# Altium project CTR-Dome-Rev-B.PrjPcb
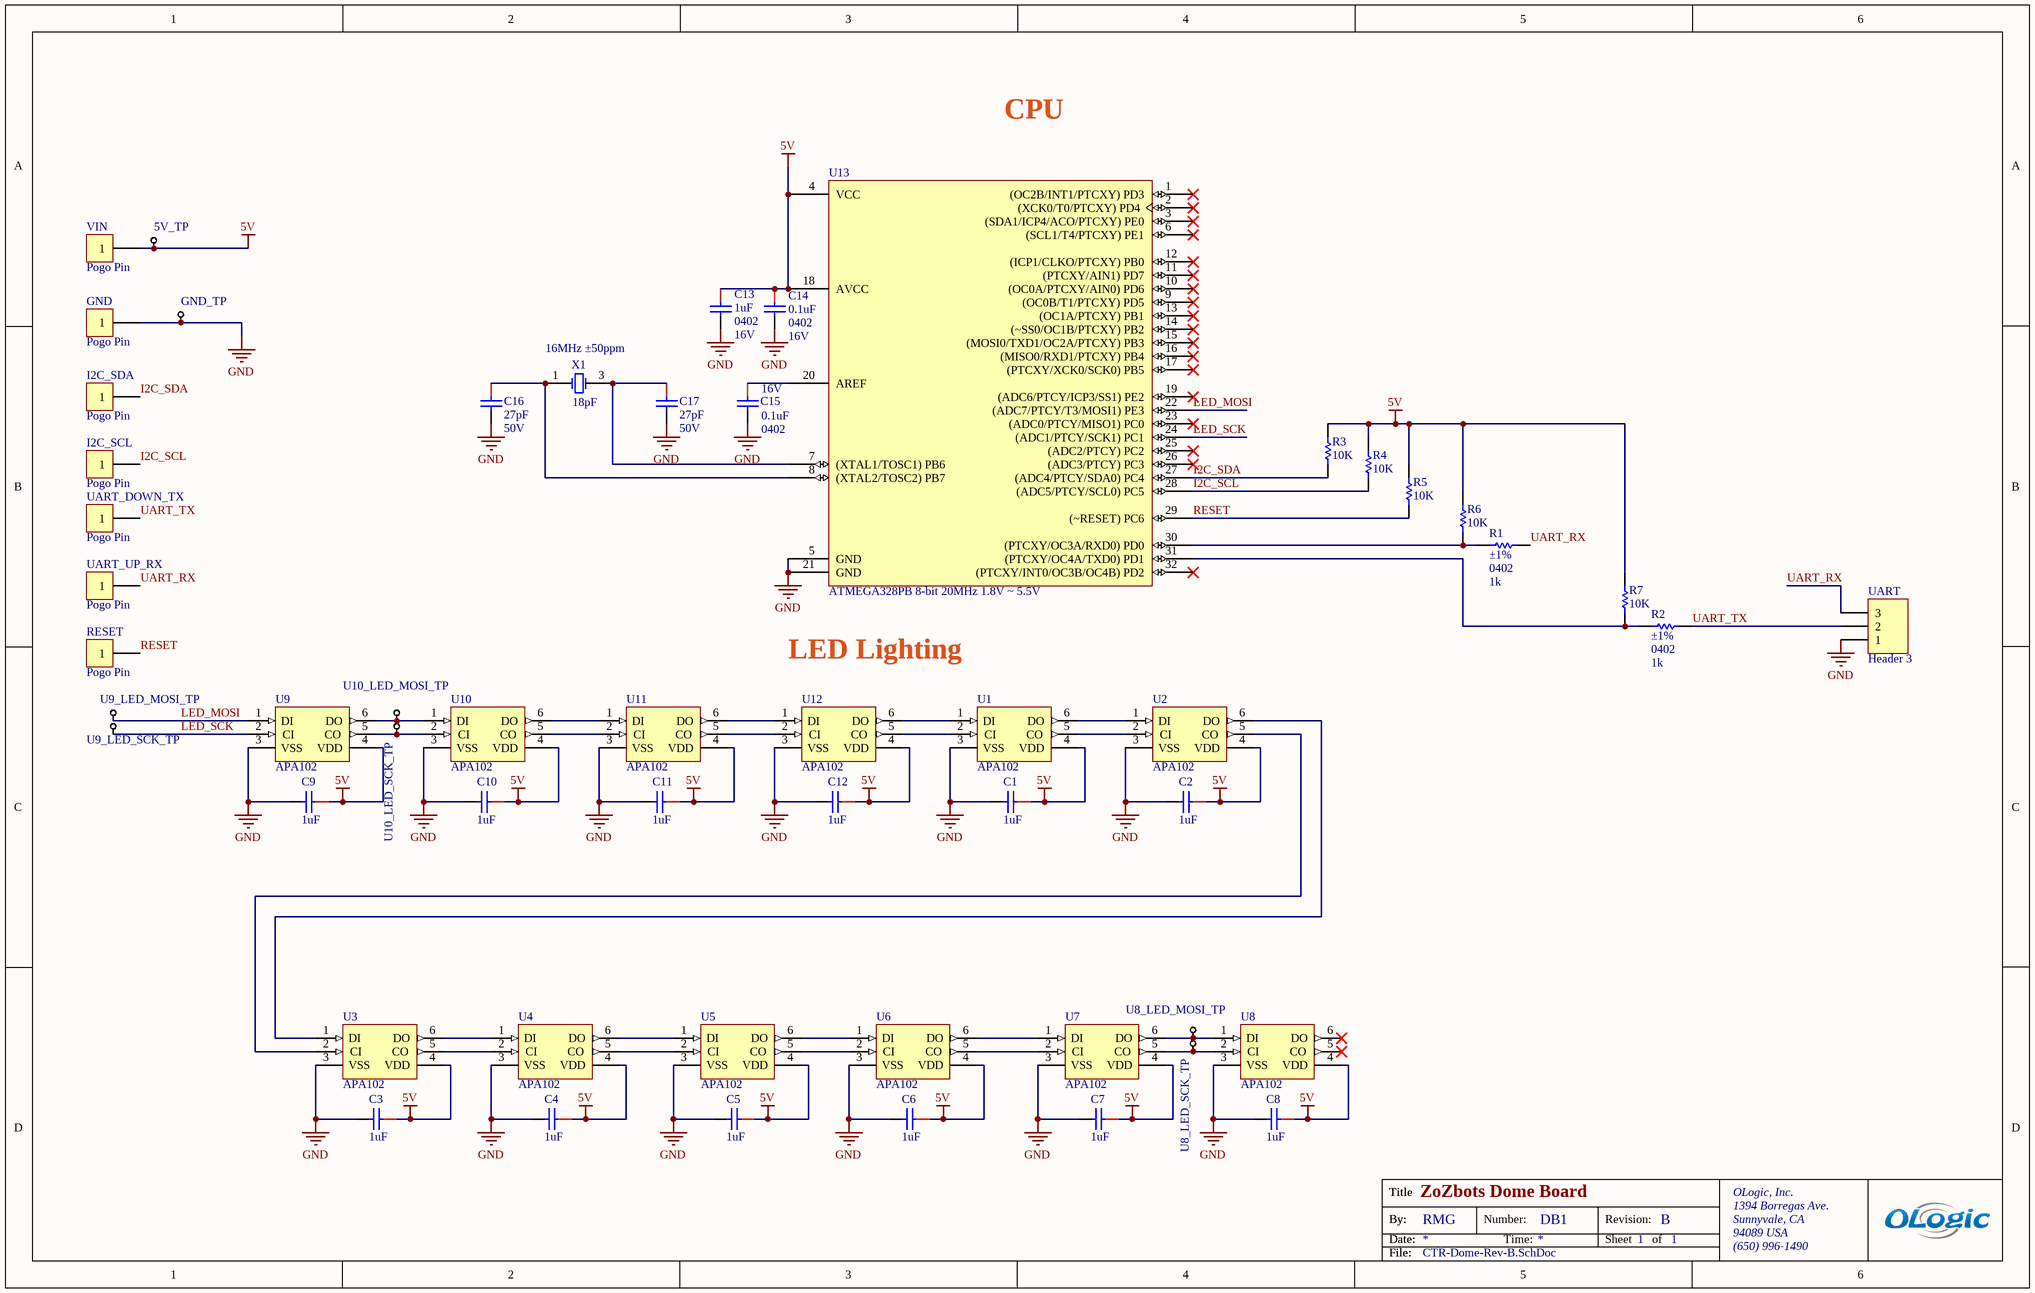
[diagram p0: CTR-Dome-Rev-B.SchDoc]
1 sheet, 54 parts. Net scope: hierarchical (ports join the sheet entries above them; power ports are global).
Board file: CTR-Dome-Rev-B.PcbDoc

## Sheet CTR-Dome-Rev-B.SchDoc: ZoZbots Dome Board
size B; Author: RMG; Organization: OLogic, Inc.; DocumentNumber: DB1; Revision: B; SheetNumber: 1; SheetTotal: 1; PageSetup: Record=PageOptions|CenterHorizontal=True|CenterVertical=True|PrintScale=0.70|XCorrection=1.00|YCorrection=1.00|PrintKind=0|BorderSize=5000000|LeftOffset=0|BottomOffset=0|Orientation=2|PaperLength=1000|PaperWidth=1000|Scale=100|PaperSource=15|PrintQuality=600|MediaType=1|DitherType=10|PrintScaleMode=1|PaperKind=Letter|PaperIndex=1

### Parts
5V_TP  Test Point  [TestPoint-TH 42 mil]  (value not drawn)  (no BOM)
C1  1uF  [CAPC0402(1005)_N]
C2  1uF  [CAPC0402(1005)_N]
C3  1uF  [CAPC0402(1005)_N]
C4  1uF  [CAPC0402(1005)_N]
C5  1uF  [CAPC0402(1005)_N]
C6  1uF  [CAPC0402(1005)_N]
C7  1uF  [CAPC0402(1005)_N]
C8  1uF  [CAPC0402(1005)_N]
C9  1uF  [CAPC0402(1005)_N]
C10  1uF  [CAPC0402(1005)_N]
C11  1uF  [CAPC0402(1005)_N]
C12  1uF  [CAPC0402(1005)_N]
C13  1uF  Voltage - Rated: 16V  Package / Case: 0402  [CAPC0402(1005)_N]
C14  0.1uF  Package / Case: 0402  Voltage - Rated: 16V  [CAPC0402(1005)_N]
C15  0.1uF  Package / Case: 0402  Voltage - Rated: 16V  [CAPC0402(1005)_N]
C16  27pF  Voltage - Rated: 50V  [CAPC0402(1005)_N]
C17  27pF  Voltage - Rated: 50V  [CAPC0402(1005)_N]
GND  Pogo Pin  [POGO_PIN]
GND_TP  Test Point  [TestPoint-TH 42 mil]  (value not drawn)  (no BOM)
I2C_SCL  Pogo Pin  [POGO_PIN]
I2C_SDA  Pogo Pin  [POGO_PIN]
R1  Tolerance: ±1%  Supplier Device Package: 0402  [RESC0402(1005)_N]  (hidden comment: 1K)
R2  Tolerance: ±1%  Supplier Device Package: 0402  [RESC0402(1005)_N]  (hidden comment: 1K)
R3  10K  [RESC0603(1608)_N]
R4  10K  [RESC0603(1608)_N]
R5  10K  [RESC0603(1608)_N]
R6  10K  [RESC0603(1608)_N]
R7  10K  [RESC0603(1608)_N]
RESET  Pogo Pin  [POGO_PIN]
U1  APA102  [APA102C]
U2  APA102  [APA102C]
U3  APA102  [APA102C]
U4  APA102  [APA102C]
U5  APA102  [APA102C]
U6  APA102  [APA102C]
U7  APA102  [APA102C]
U8  APA102  [APA102C]
U8_LED_MOSI_TP  Test Point  [TestPoint-TH 42 mil]  (value not drawn)  (no BOM)
U8_LED_SCK_TP  Test Point  [TestPoint-TH 42 mil]  (value not drawn)  (no BOM)
U9  APA102  [APA102C]
U9_LED_MOSI_TP  Test Point  [TestPoint-TH 42 mil]  (value not drawn)  (no BOM)
U9_LED_SCK_TP  Test Point  [TestPoint-TH 42 mil]  (value not drawn)  (no BOM)
U10  APA102  [APA102C]
U10_LED_MOSI_TP  Test Point  [TestPoint-TH 42 mil]  (value not drawn)  (no BOM)
U10_LED_SCK_TP  Test Point  [TestPoint-TH 42 mil]  (value not drawn)  (no BOM)
U11  APA102  [APA102C]
U12  APA102  [APA102C]
U13  ATMEGA328PB 8-bit 20MHz 1.8V ~ 5.5V  [QFN 32 (VFQFN ATMEL ATMEGA)]
UART  Header 3  [HDR1X3]  (no BOM)
UART_DOWN_TX  Pogo Pin  [POGO_PIN]
UART_UP_RX  Pogo Pin  [POGO_PIN]
VIN  Pogo Pin  [POGO_PIN]
X1  16MHz ±50ppm  Load Capacitance: 18pF  [SMXOSC/3.2X2.5]

### Nets
5V: 5V_TP.1 C1.1 C2.1 C3.1 C4.1 C5.1 C6.1 C7.1 C8.1 C9.1 C10.1 C11.1 C12.1 C13.1 C14.1 R3.2 R4.2 R5.2 R6.2 R7.2 U1.4(VDD) U2.4(VDD) U3.4(VDD) U4.4(VDD) U5.4(VDD) U6.4(VDD) U7.4(VDD) U8.4(VDD) U9.4(VDD) U10.4(VDD) U11.4(VDD) U12.4(VDD) U13.4(VCC) U13.18(AVCC) VIN.1
GND: C1.2 C2.2 C3.2 C4.2 C5.2 C6.2 C7.2 C8.2 C9.2 C10.2 C11.2 C12.2 C13.2 C14.2 C15.2 C16.2 C17.2 GND.1 GND_TP.1 U1.3(VSS) U2.3(VSS) U3.3(VSS) U4.3(VSS) U5.3(VSS) U6.3(VSS) U7.3(VSS) U8.3(VSS) U9.3(VSS) U10.3(VSS) U11.3(VSS) U12.3(VSS) U13.5(GND) U13.21(GND) U13.33 UART.1
I2C_SCL: I2C_SCL.1 R4.1 U13.28((ADC5/PTCY/SCL0)_PC5)
I2C_SDA: I2C_SDA.1 R3.1 U13.27((ADC4/PTCY/SDA0)_PC4)
LED_MOSI: U9.1(DI) U9_LED_MOSI_TP.1 U13.22((ADC7/PTCY/T3/MOSI1)_PE3)
LED_SCK: U9.2(CI) U9_LED_SCK_TP.1 U13.24((ADC1/PTCY/SCK1)_PC1)
RESET: R5.1 RESET.1 U13.29((~RESET)_PC6)
UART_RX: R1.2 UART.3 UART_UP_RX.1
UART_TX: R2.2 UART.2 UART_DOWN_TX.1
NetC15_1: C15.1 U13.20(AREF)
NetC16_1: C16.1 U13.8((XTAL2/TOSC2)_PB7) X1.1(OSC1)
NetC17_1: C17.1 U13.7((XTAL1/TOSC1)_PB6) X1.3(OSC2)
NetR1_1: R1.1 R6.1 U13.30((PTCXY/OC3A/RXD0)_PD0)
NetR2_1: R2.1 R7.1 U13.31((PTCXY/OC4A/TXD0)_PD1)
NetU1_1: U1.1(DI) U12.6(DO)
NetU1_2: U1.2(CI) U12.5(CO)
NetU1_5: U1.5(CO) U2.2(CI)
NetU1_6: U1.6(DO) U2.1(DI)
NetU2_5: U2.5(CO) U3.2(CI)
NetU2_6: U2.6(DO) U3.1(DI)
NetU3_5: U3.5(CO) U4.2(CI)
NetU3_6: U3.6(DO) U4.1(DI)
NetU4_5: U4.5(CO) U5.2(CI)
NetU4_6: U4.6(DO) U5.1(DI)
NetU5_5: U5.5(CO) U6.2(CI)
NetU5_6: U5.6(DO) U6.1(DI)
NetU6_5: U6.5(CO) U7.2(CI)
NetU6_6: U6.6(DO) U7.1(DI)
NetU7_5: U7.5(CO) U8.2(CI) U8_LED_SCK_TP.1
NetU7_6: U7.6(DO) U8.1(DI) U8_LED_MOSI_TP.1
NetU9_5: U9.5(CO) U10.2(CI) U10_LED_SCK_TP.1
NetU9_6: U9.6(DO) U10.1(DI) U10_LED_MOSI_TP.1
NetU10_5: U10.5(CO) U11.2(CI)
NetU10_6: U10.6(DO) U11.1(DI)
NetU11_5: U11.5(CO) U12.2(CI)
NetU11_6: U11.6(DO) U12.1(DI)

Not connected (* = marked no-connect by the designer): U8 5(CO)* 6(DO)*; U13 1((OC2B/INT1/PTCXY)_PD3)* 2((XCK0/T0/PTCXY)_PD4)* 3((SDA1/ICP4/ACO/PTCXY)_PE0)* 6((SCL1/T4/PTCXY)_PE1)* 9((OC0B/T1/PTCXY)_PD5)* 10((OC0A/PTCXY/AIN0)_PD6)* 11((PTCXY/AIN1)_PD7)* 12((ICP1/CLKO/PTCXY)_PB0)* 13((OC1A/PTCXY)_PB1)* 14((~SS0/OC1B/PTCXY)_PB2)* 15((MOSI0/TXD1/OC2A/PTCXY)_PB3)* 16((MISO0/RXD1/PTCXY)_PB4)* 17((PTCXY/XCK0/SCK0)_PB5)* 19((ADC6/PTCY/ICP3/SS1)_PE2)* 23((ADC0/PTCY/MISO1)_PC0)* 25((ADC2/PTCY)_PC2)* 26((ADC3/PTCY)_PC3)* 32((PTCXY/INT0/OC3B/OC4B)_PD2)*; X1 2(NC) 4(NC)

### Notes on the sheet
- CPU
- LED Lighting
- Title
- By:
- Date:
- Number:
- Time:
- Revision:
- Sheet
- of
- OLogic, Inc.
- 1394 Borregas Ave.
- Sunnyvale, CA
- 94089 USA
- File:
- (650) 996-1490

### Library data of the parts
5V_TP GND_TP U8_LED_MOSI_TP U8_LED_SCK_TP U9_LED_MOSI_TP U9_LED_SCK_TP U10_LED_MOSI_TP U10_LED_SCK_TP = TestPoint, small
C1-C12 = CAP CER 1UF 16V 10% X5R 0402: 1UF 0402; Manufacturer: TDK Corporation; Manufacturer Part Number: C1005X5R1C105K050BC; Capacitance: 1.0µF; Tolerance: ±10%; Voltage - Rated: 16V; Temperature Coefficient: X5R; ClassName: LED; Supplier 1: Digi-Key; RoHS: RoHS Compliant; Category: Capacitors; Stock 1: 490204; Pricing 1: 1=0.12, 10=0.08, 100=0.038, 250=0.032, 500=0.0268, 1000=0.022, 5000=0.0186 (USD); Packaging: Cut Tape (CT); Mounting Type: Surface Mount, MLCC; Operating Temperature: -55°C ~ 85°C; Applications: General Purpose; Ratings: -; Package / Case: 0402 (1005 Metric); Size / Dimension: 0.039" L x 0.020" W (1.00mm x 0.50mm); Height - Seated (Max): -; Thickness (Max): 0.022" (0.55mm); Lead Spacing: -; Features: -; Lead Style: -; ComponentLink1URL: http://product.tdk.com/en/catalog/datasheets/mlcc_commercial_general_en.pdf; ComponentLink1Description: http://product.tdk.com/en/catalog/datasheets/mlcc_commercial_general_en.pdf; Supplier Part Number 1: 445-4978-1-ND
C13 = CAP CER 1UF 16V 10% X5R 0402: 1UF 0402; Manufacturer: TDK Corporation; Manufacturer Part Number: C1005X5R1C105K050BC; Capacitance: 1.0µF; Tolerance: ±10%; Temperature Coefficient: X5R; ClassName: LED; Supplier 1: Digi-Key; RoHS: RoHS Compliant; Category: Capacitors; Stock 1: 490204; Pricing 1: 1=0.12, 10=0.08, 100=0.038, 250=0.032, 500=0.0268, 1000=0.022, 5000=0.0186 (USD); Packaging: Cut Tape (CT); Mounting Type: Surface Mount, MLCC; Operating Temperature: -55°C ~ 85°C; Applications: General Purpose; Ratings: -; Size / Dimension: 0.039" L x 0.020" W (1.00mm x 0.50mm); Height - Seated (Max): -; Thickness (Max): 0.022" (0.55mm); Lead Spacing: -; Features: -; Lead Style: -; ComponentLink1URL: http://product.tdk.com/en/catalog/datasheets/mlcc_commercial_general_en.pdf; ComponentLink1Description: http://product.tdk.com/en/catalog/datasheets/mlcc_commercial_general_en.pdf; Supplier Part Number 1: 445-4978-1-ND
C14 C15 = CAP CER 0.1UF 16V 10% X5R 0402: 0.1uF 0402 16V; Manufacturer: Taiyo Yuden; Manufacturer Part Number: EMK105BJ104KV-F; Capacitance: 0.1µF; Tolerance: ±10%; Temperature Coefficient: X5R; Supplier 1: Digi-Key; RoHS: RoHS Compliant; Category: Capacitors; Stock 1: 590000; Pricing 1: 10000=0.0042, 20000=0.004, 30000=0.0038, 50000=0.0034 (USD); Packaging: Tape & Reel (TR); Mounting Type: Surface Mount, MLCC; Operating Temperature: -55°C ~ 85°C; Applications: General Purpose; Ratings: -; Size / Dimension: 0.039" L x 0.020" W (1.00mm x 0.50mm); Height - Seated (Max): -; Thickness (Max): 0.022" (0.55mm); Lead Spacing: -; Features: -; Lead Style: -; ComponentLink1URL: http://www.yuden.co.jp/or/product/category/capacitor/EMK105BJ104KV-F.pdf; ComponentLink1Description: http://www.yuden.co.jp/or/product/category/capacitor/EMK105BJ104KV-F.pdf; Supplier Part Number 1: 587-1226-2-ND
C16 C17 = CAP CER 27PF 50V C0G/NP0 0402: 27PF ±5% 50V 0402; Manufacturer: Samsung Electro-Mechanics America, Inc.; Manufacturer Part Number: CL05C270JB5NNNC; Temperature Coefficient: C0G, NP0; Supplier 1: Digi-Key; RoHS: RoHS Compliant; Category: Capacitors; Stock 1: 380291; Pricing 1: 1=0.1, 10=0.012, 25=0.0088, 50=0.0066, 100=0.0055, 250=0.00456, 500=0.0039, 1000=0.00306, 5000=0.00256 (USD); Packaging: Cut Tape (CT); Part Status: Active; Capacitance: 27pF; Tolerance: ±5%; Operating Temperature: -55°C ~ 125°C; Features: -; Ratings: -; Applications: General Purpose; Mounting Type: Surface Mount, MLCC; Package / Case: 0402 (1005 Metric); Size / Dimension: 0.039" L x 0.020" W (1.00mm x 0.50mm); Height - Seated (Max): -; Thickness (Max): 0.022" (0.55mm); Lead Spacing: -; Lead Style: -; ComponentLink1URL: http://www.samsungsem.com/kr/support/product-search/mlcc/CL05C270JB5NNNC.jsp; ComponentLink1Description: http://www.samsungsem.com/kr/support/product-search/mlcc/CL05C270JB5NNNC.jsp; Supplier Part Number 1: 1276-1153-1-ND
GND I2C_SCL I2C_SDA RESET UART_DOWN_TX UART_UP_RX VIN = 0850-0-15-20-83-14-11-0: Manufacturer: Mill-Max Manufacturing Corp.; Plating: Gold; Plating - Thickness: 20µin (0.51µm); Supplier 1: Digi-Key; Manufacturer Part Number: 0850-0-15-20-83-14-11-0; RoHS: RoHS Compliant; Category: Connectors, Interconnects; Stock 1: 38651; Pricing 1: 1=1.89, 10=1.47, 25=1.3708, 50=1.246, 100=1.1214, 250=0.94696, 500=0.89712, 1000=0.79744, 2500=0.66287 (USD); Part Status: Active; Material: Copper Alloy; Mounting Type: Through Hole; ComponentLink1URL: http://www.mill-max.com/assets/pdfs/028.pdf; ComponentLink1Description: http://www.mill-max.com/assets/pdfs/028.pdf; Supplier Part Number 1: ED90436-ND
R1 R2 = RES 1K OHM 1% 1/10W 0402: 1K 0402; Manufacturer: Panasonic Electronic Components; Manufacturer Part Number: ERJ-2RKF1001X; Power (Watts): 0.1W, 1/10W; Temperature Coefficient: ±100ppm/°C; Supplier 1: Digi-Key; RoHS: RoHS Compliant; Category: Resistors; Stock 1: 3895934; Pricing 1: 1=0.1, 50=0.0196, 100=0.0149, 250=0.01104, 500=0.00816, 1000=0.00544, 5000=0.00383 (USD); Packaging: Cut Tape (CT); Composition: Thick Film; Features: Automotive AEC-Q200; Operating Temperature: -55°C ~ 155°C; Package / Case: 0402 (1005 Metric); Size / Dimension: 0.039" L x 0.020" W (1.00mm x 0.50mm); Height: 0.016" (0.40mm); Number of Terminations: 2; ComponentLink1URL: http://industrial.panasonic.com/www-cgi/jvcr13pz.cgi?E+PZ+3+AOA0002+ERJ2RKF1001X+7+WW; ComponentLink1Description: http://industrial.panasonic.com/www-cgi/jvcr13pz.cgi?E+PZ+3+AOA0002+ERJ2RKF1001X+7+WW; Supplier Part Number 1: P1.00KLCT-ND; Creator: osman; Resistance (Ohms): 1k
R3-R7 = RES 10K OHM 1/10W 5% 0603 SMD: 10K 0603; Manufacturer: Panasonic Electronic Components; Manufacturer Part Number: ERJ-3GEYJ103V; Tolerance: ±5%; Power (Watts): 0.1W, 1/10W; Temperature Coefficient: ±200ppm/°C; Supplier 1: Digi-Key; RoHS: RoHS Compliant; Category: Resistors; Stock 1: 4724855; Pricing 1: 1=0.1, 50=0.0126, 100=0.0096, 250=0.00716, 500=0.00528, 1000=0.00352, 2500=0.00297 (USD); Packaging: Cut Tape (CT); Resistance (Ohms): 10k; Composition: Thick Film; Features: -; Package / Case: 0603 (1608 Metric); Supplier Device Package: 0603; Size / Dimension: 0.063" L x 0.031" W (1.60mm x 0.80mm); Height: 0.022" (0.55mm); Number of Terminations: 2; ComponentLink1URL: http://industrial.panasonic.com/www-cgi/jvcr13pz.cgi?E+PZ+3+AOA0001+ERJ3GEYJ103V+7+WW; ComponentLink1Description: http://industrial.panasonic.com/www-cgi/jvcr13pz.cgi?E+PZ+3+AOA0001+ERJ3GEYJ103V+7+WW; Supplier Part Number 1: P10KGCT-ND
U1-U12 = APA102: APA102 RGB LED with serial controller; Manufacturer: Shiji Lighting; MPN: APA102C; ClassName: LED
U13 = ATMEGA328PB-AU: AVR ATmega Microcontroller IC 8-Bit 20MHz 32KB (16K x 16) FLASH 32-VFQFN (5x5); Manufacturer: Atmel; Connectivity: I²C, SPI, UART/USART; Peripherals: Brown-out Detect/Reset, POR, PWM, WDT; Number of I/O: 27; EEPROM Size: 1K x 8; RAM Size: 2K x 8; Data Converters: A/D 8x10b; Oscillator Type: Internal; Supplier 1: Digikey; Manufacturer Part Number: ATMEGA328PB-AU; Stock 1: 4992; Pricing 1: 1=1.38, 25=1.2668, 100=1.1536 (USD); Category: Integrated Circuits (ICs); Family: Embedded - Microcontrollers; Series: AVR® ATmega; Packaging: Tray; Core Processor: AVR; Core Size: 8-Bit; Speed: 20MHz; Program Memory Size: 32KB (16K x 16); Program Memory Type: FLASH; Voltage - Supply (Vcc/Vdd): 1.8 V ~ 5.5 V; Operating Temperature: -40°C ~ 85°C (TA); Package / Case: 32-TQFP; Supplier Device Package: 32-TQFP (7x7); ComponentLink1URL: http://www.atmel.com/images/atmel-42397-8-bit-avr-microcontroller-atmega328pb_summary.pdf; ComponentLink1Description: http://www.atmel.com/images/atmel-42397-8-bit-avr-microcontroller-atmega328pb_summary.pdf; ComponentLink2URL: http://www.farnell.com/datasheets/2014286.pdf; ComponentLink2Description: http://www.farnell.com/datasheets/2014286.pdf; Supplier Part Number 1: ATMEGA328PB-AU-ND
UART = Header 3: Header, 3-Pin; Manufacturer: Sullins Connector Solutions; Manufacturer Part Number: PRPC003SAAN-RC; Connector Type: Header, Unshrouded, Breakaway; Number of Positions: 3; Number of Positions Loaded: All; Pitch: 0.100" (2.54mm); Supplier 1: Digi-Key; RoHS: RoHS Compliant; Category: Connectors, Interconnects; Stock 1: 0; Pricing 1: 1=0.18, 10=0.16, 100=0.132, 500=0.10438, 1000=0.0896, 5000=0.08174, 10000=0.0786 (USD); Packaging: Bulk; Contact Type: Male Pin; Number of Rows: 1; Row Spacing: -; Contact Mating Length: 0.230" (5.84mm); Mounting Type: Through Hole; Termination: Solder; Fastening Type: -; Features: -; Contact Finish: Gold; Contact Finish Thickness: Flash; Color: Black; ComponentLink1URL: http://media.digikey.com/PDF/Data%20Sheets/Sullins%20PDFs/xRxCzzzSxxN-RC_ST_11635-B.pdf; ComponentLink1Description: http://media.digikey.com/PDF/Data%20Sheets/Sullins%20PDFs/xRxCzzzSxxN-RC_ST_11635-B.pdf; Supplier Part Number 1: S1011EC-03-ND
X1 = CRYSTAL 16.0000MHZ 18PF 4-SMD: 16MHz ±50ppm Crystal 18pF 80 Ohm -20°C ~ 70°C Surface Mount 4-SMD, No Lead; Manufacturer: EPSON; Manufacturer Part Number: FA-238 16.0000MB-C3; Frequency Stability: ±30ppm; ESR (Equivalent Series Resistance): 80 Ohm; Operating Mode: Fundamental; Supplier 1: Digi-Key; RoHS: RoHS Compliant; Category: Crystals, Oscillators, Resonators; Stock 1: 2934; Pricing 1: 1=0.43, 10=0.358, 50=0.3218, 100=0.286 (USD); Packaging: Cut Tape (CT); Part Status: Active; Type: MHz Crystal; Frequency: 16MHz; Frequency Tolerance: ±50ppm; Operating Temperature: -20°C ~ 70°C; Ratings: -; Mounting Type: Surface Mount; Package / Case: 4-SMD, No Lead; Size / Dimension: 0.126" L x 0.098" W (3.20mm x 2.50mm); Height - Seated (Max): 0.028" (0.70mm); ComponentLink1URL: https://support.epson.biz/td/api/doc_check.php?dl=brief_FA-238V_en.pdf; ComponentLink1Description: https://support.epson.biz/td/api/doc_check.php?dl=brief_FA-238V_en.pdf; Supplier 2: Digi-Key; Supplier Part Number 1: SER3686CT-ND; Supplier Part Number 2: SER3686TR-ND

## Assembly variants
No HDR: not fitted UART